# EAGLE schematic 01 Raspberry Hat 6 Schematic (EAGLE 8.5.2)

## Sheet 1 of 2
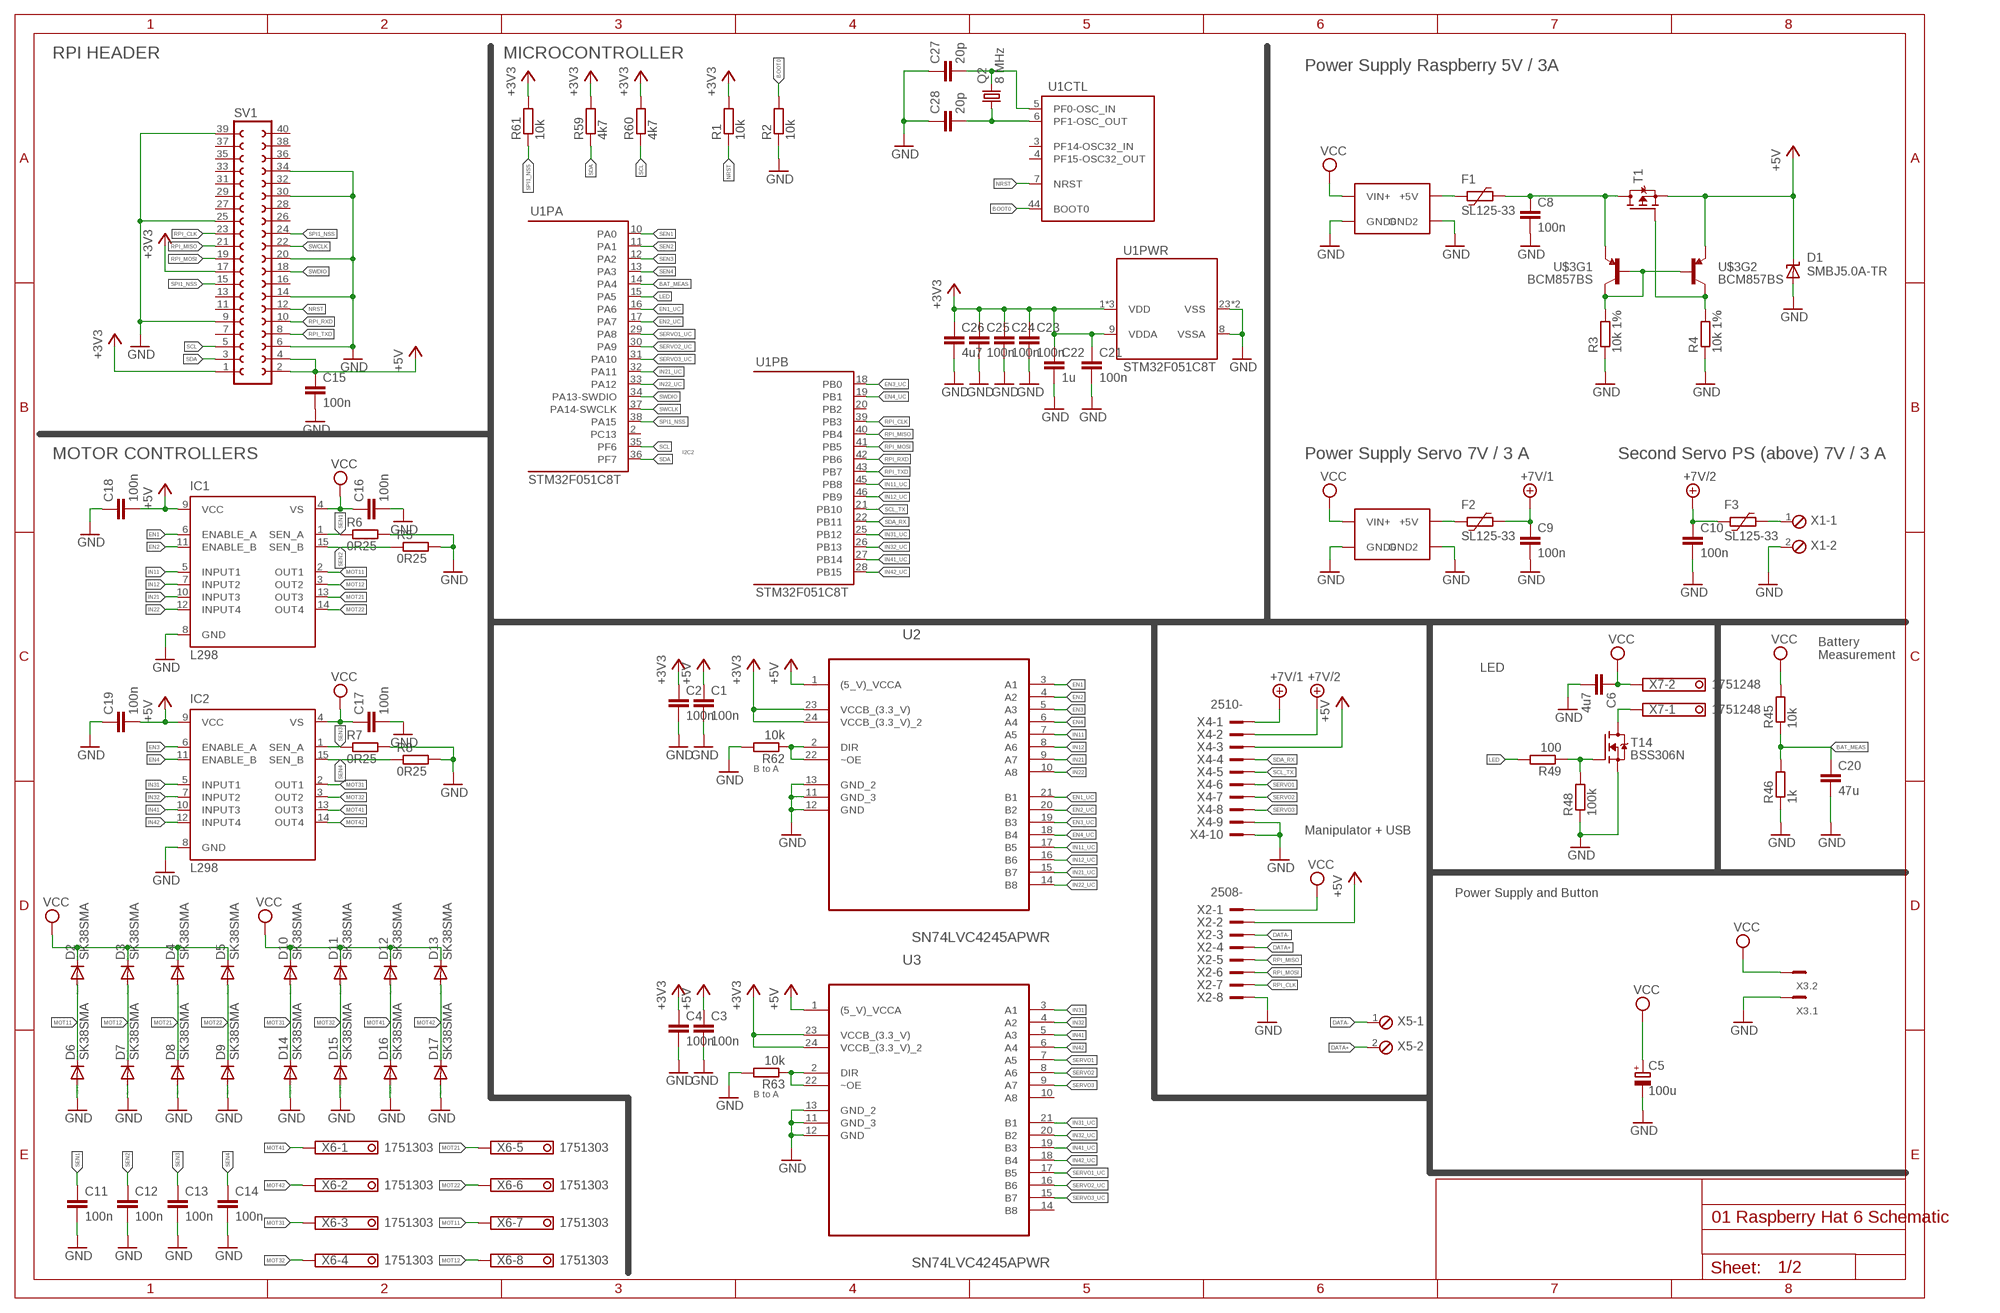
[diagram p0: schematic, sheet 1]

### Parts
C1  100n  C-EUC0805  [C0805]
C2  100n  C-EUC0805  [C0805]
C3  100n  C-EUC0805  [C0805]
C4  100n  C-EUC0805  [C0805]
C5  100u  CPOL-EU153CLV-0807  [153CLV-0807]
C6  4u7  C-EUC0805  [C0805]
C8  100n  C-EUC0805  [C0805]
C9  100n  C-EUC0805  [C0805]
C10  100n  C-EUC0805  [C0805]
C11  100n  C-EUC0805  [C0805]
C12  100n  C-EUC0805  [C0805]
C13  100n  C-EUC0805  [C0805]
C14  100n  C-EUC0805  [C0805]
C15  100n  C-EUC0805  [C0805]
C16  100n  C-EUC0805  [C0805]
C17  100n  C-EUC0805  [C0805]
C18  100n  C-EUC0805  [C0805]
C19  100n  C-EUC0805  [C0805]
C20  47u  C-EUC0805  [C0805]
C21  100n  C-EUC0805  [C0805]
C22  1u  C-EUC0805  [C0805]
C23  100n  C-EUC0805  [C0805]
C24  100n  C-EUC0805  [C0805]
C25  100n  C-EUC0805  [C0805]
C26  4u7  C-EUC0805  [C0805]
C27  20p  C-EUC0805  [C0805]
C28  20p  C-EUC0805  [C0805]
D1  SMBJ5.0A-TR  SUPPRESSOR-SMBJ  [SMBJ]
D2  SK38SMA  DIODE-DO214AC  [DO214AC]
D3  SK38SMA  DIODE-DO214AC  [DO214AC]
D4  SK38SMA  DIODE-DO214AC  [DO214AC]
D5  SK38SMA  DIODE-DO214AC  [DO214AC]
D6  SK38SMA  DIODE-DO214AC  [DO214AC]
D7  SK38SMA  DIODE-DO214AC  [DO214AC]
D8  SK38SMA  DIODE-DO214AC  [DO214AC]
D9  SK38SMA  DIODE-DO214AC  [DO214AC]
D10  SK38SMA  DIODE-DO214AC  [DO214AC]
D11  SK38SMA  DIODE-DO214AC  [DO214AC]
D12  SK38SMA  DIODE-DO214AC  [DO214AC]
D13  SK38SMA  DIODE-DO214AC  [DO214AC]
D14  SK38SMA  DIODE-DO214AC  [DO214AC]
D15  SK38SMA  DIODE-DO214AC  [DO214AC]
D16  SK38SMA  DIODE-DO214AC  [DO214AC]
D17  SK38SMA  DIODE-DO214AC  [DO214AC]
F1  SL125-33  2920L050  [2920L]
F2  SL125-33  2920L050  [2920L]
F3  SL125-33  2920L050  [2920L]
IC1  L298  [MULTIWATT-15]
IC2  L298  [MULTIWATT-15]
Q2  8 MHz  CRYSTALHC49UP  [HC49UP]
R1  10k  R-EU_M0805  [M0805]
R2  10k  R-EU_M0805  [M0805]
R3  10k 1%  R-EU_M0805  [M0805]
R4  10k 1%  R-EU_M0805  [M0805]
R5  0R25  R-EU_R2512  [R2512]
R6  0R25  R-EU_R2512  [R2512]
R7  0R25  R-EU_R2512  [R2512]
R8  0R25  R-EU_R2512  [R2512]
R45  10k  R-EU_M0805  [M0805]
R46  1k  R-EU_M0805  [M0805]
R48  100k  R-EU_M0805  [M0805]
R49  100  R-EU_M0805  [M0805]
R59  4k7  R-EU_M0805  [M0805]
R60  4k7  R-EU_M0805  [M0805]
R61  10k  R-EU_M0805  [M0805]
R62  10k  R-EU_M0805  [M0805]
R63  10k  R-EU_M0805  [M0805]
SV1  FE20-2  [FE20-2]
T1  MOSFET-P-SOT23  [SOT23]
T14  BSS306N  MOSFET-N-SOT23  [SOT23]
U1  STM32F051C8T  [LQFP48]
U2  SN74LVC4245APWR  [SOP65P640X120-24N]
U3  SN74LVC4245APWR  [SOP65P640X120-24N]
U$2  LM2596_CONVERTER  [LM2596_CONVERTER]
U$3  BCM857BS  [SOT363]
U$4  LM2596_CONVERTER  [LM2596_CONVERTER]
X1  MPT2  [2POL254]
X2  2508-  [PAK100/2500-10]
X3  MC2  [MC2]
X4  2510-  [PAK100/2500-10]
X5  MPT2  [2POL254]
X6  1751303  [1751303]
X7  1751248  [1751248]

### Nets
+3V3: C2.1 C4.1 C21.1 C22.1 C23.1 C24.1 C25.1 C26.1 R1.2 R59.2 R60.2 R61.2 SV1.1 SV1.17 U1.1(PWR:VDD) U1.9(PWR:VDDA) U1.24(PWR:VDD) U1.48(PWR:VDD) U2.23(VCCB_(3.3_V)) U2.24(VCCB_(3.3_V)_2) U3.23(VCCB_(3.3_V)) U3.24(VCCB_(3.3_V)_2)
+5V: C1.1 C3.1 C15.1 C18.2 C19.2 D1.C IC1.9(VCC) IC2.9(VCC) SV1.2 SV1.4 T1.2(S) U2.1((5_V)_VCCA) U3.1((5_V)_VCCA) U$3.4(E) X2.2 X4.3
+7V/1: C9.1 F2.1 X4.1
+7V/2: C10.1 F3.2 X4.2
BAT_MEAS: C20.1 R45.1 R46.2 U1.14(PA:PA4)
BOOT0: R2.2 U1.44(CTL:BOOT0)
DATA+: X2.4 X5.2
DATA-: X2.3 X5.1
EN1: IC1.6(ENABLE_A) U2.3(A1)
EN1_UC: U1.16(PA:PA6) U2.21(B1)
EN2: IC1.11(ENABLE_B) U2.4(A2)
EN2_UC: U1.17(PA:PA7) U2.20(B2)
EN3: IC2.6(ENABLE_A) U2.5(A3)
EN3_UC: U1.18(PB:PB0) U2.19(B3)
EN4: IC2.11(ENABLE_B) U2.6(A4)
EN4_UC: U1.19(PB:PB1) U2.18(B4)
GND: C1.2 C2.2 C3.2 C4.2 C5.- C6.2 C8.2 C9.2 C10.2 C11.2 C12.2 C13.2 C14.2 C15.2 C16.2 C17.2 C18.1 C19.1 C20.2 C21.2 C22.2 C23.2 C24.2 C25.2 C26.2 C27.1 C28.1 D1.A D6.A D7.A D8.A D9.A D14.A D15.A D16.A D17.A IC1.8(GND) IC2.8(GND) R2.1 R3.1 R4.1 R5.2 R6.2 R7.2 R8.2 R46.1 R48.1 R62.2 R63.2 SV1.6 SV1.9 SV1.14 SV1.20 SV1.25 SV1.30 SV1.34 SV1.39 T14.2(S) U1.8(PWR:VSSA) U1.23(PWR:VSS) U1.47(PWR:VSS) U2.11(GND_3) U2.12(GND) U2.13(GND_2) U3.11(GND_3) U3.12(GND) U3.13(GND_2) U$2.GND1(GND2) U$2.GND(GND0) U$4.GND1(GND2) U$4.GND(GND0) X1.2 X2.8 X3.1 X4.9 X4.10
IN11: IC1.5(INPUT1) U2.7(A5)
IN11_UC: U1.45(PB:PB8) U2.17(B5)
IN12: IC1.7(INPUT2) U2.8(A6)
IN12_UC: U1.46(PB:PB9) U2.16(B6)
IN21: IC1.10(INPUT3) U2.9(A7)
IN21_UC: U1.32(PA:PA11) U2.15(B7)
IN22: IC1.12(INPUT4) U2.10(A8)
IN22_UC: U1.33(PA:PA12) U2.14(B8)
IN31: IC2.5(INPUT1) U3.3(A1)
IN31_UC: U1.25(PB:PB12) U3.21(B1)
IN32: IC2.7(INPUT2) U3.4(A2)
IN32_UC: U1.26(PB:PB13) U3.20(B2)
IN41: IC2.10(INPUT3) U3.5(A3)
IN41_UC: U1.27(PB:PB14) U3.19(B3)
IN42: IC2.12(INPUT4) U3.6(A4)
IN42_UC: U1.28(PB:PB15) U3.18(B4)
LED: R49.2 U1.15(PA:PA5)
MOT11: D2.A D6.C IC1.2(OUT1) X6.7
MOT12: D3.A D7.C IC1.3(OUT2) X6.8
MOT21: D4.A D8.C IC1.13(OUT3) X6.5
MOT22: D5.A D9.C IC1.14(OUT4) X6.6
MOT31: D10.A D14.C IC2.2(OUT1) X6.3
MOT32: D11.A D15.C IC2.3(OUT2) X6.4
MOT41: D12.A D16.C IC2.13(OUT3) X6.1
MOT42: D13.A D17.C IC2.14(OUT4) X6.2
N$1: R62.1 U2.2(DIR) U2.22(~OE)
N$2: R63.1 U3.2(DIR) U3.22(~OE)
N$3: F1.2 U$2.+5V
N$4: C8.1 F1.1 T1.3(D) U$3.1(E)
N$5: F3.1 X1.1
N$6: R4.2 T1.1(G) U$3.3(C)
N$8: R3.2 U$3.2(B) U$3.5(B) U$3.6(C)
N$10: F2.2 U$4.+5V
N$21: R48.2 R49.1 T14.1(G)
N$24: T14.3(D) X7.1
N$28: C28.2 Q2.1 U1.6(CTL:PF1-OSC_OUT)
N$29: C27.2 Q2.2 U1.5(CTL:PF0-OSC_IN)
NRST: R1.1 SV1.12 U1.7(CTL:NRST)
RPI_CLK: SV1.23 U1.39(PB:PB3) X2.7
RPI_MISO: SV1.21 U1.40(PB:PB4) X2.5
RPI_MOSI: SV1.19 U1.41(PB:PB5) X2.6
RPI_RXD: SV1.10 U1.42(PB:PB6)
RPI_TXD: SV1.8 U1.43(PB:PB7)
SCL: R60.1 SV1.5 U1.35(PA:PF6)
SCL_TX: U1.21(PB:PB10) X4.5
SDA: R59.1 SV1.3 U1.36(PA:PF7)
SDA_RX: U1.22(PB:PB11) X4.4
SEN1: C11.1 IC1.1(SEN_A) R6.1 U1.10(PA:PA0)
SEN2: C12.1 IC1.15(SEN_B) R5.1 U1.11(PA:PA1)
SEN3: C13.1 IC2.1(SEN_A) R7.1 U1.12(PA:PA2)
SEN4: C14.1 IC2.15(SEN_B) R8.1 U1.13(PA:PA3)
SERVO1: U3.7(A5) X4.6
SERVO1_UC: U1.29(PA:PA8) U3.17(B5)
SERVO2: U3.8(A6) X4.7
SERVO2_UC: U1.30(PA:PA9) U3.16(B6)
SERVO3: U3.9(A7) X4.8
SERVO3_UC: U1.31(PA:PA10) U3.15(B7)
SPI1_NSS: R61.1 SV1.15 SV1.24 U1.38(PA:PA15)
SWCLK: SV1.22 U1.37(PA:PA14-SWCLK)
SWDIO: SV1.18 U1.34(PA:PA13-SWDIO)
VCC: C5.+ C6.1 C16.1 C17.1 D2.C D3.C D4.C D5.C D10.C D11.C D12.C D13.C IC1.4(VS) IC2.4(VS) R45.2 U$2.IN+(VIN+) U$4.IN+(VIN+) X2.1 X3.2 X7.2
Unconnected: SV1.7 SV1.11 SV1.13 SV1.16 SV1.26 SV1.27 SV1.28 SV1.29 SV1.31 SV1.32 SV1.33 SV1.35 SV1.36 SV1.37 SV1.38 SV1.40 U1.2(PA:PC13) U1.3(CTL:PF14-OSC32_IN) U1.4(CTL:PF15-OSC32_OUT) U1.20(PB:PB2) U3.10(A8) U3.14(B8)

### Notes on the sheet
- RPI HEADER | MICROCONTROLLER
- Power Supply Raspberry 5V / 3A
- I2C2
- MOTOR CONTROLLERS | Power Supply Servo 7V / 3 A | Second Servo PS (above) 7V / 3 A
- Battery
  Measurement
- LED
- B to A
- Manipulator + USB
- Power Supply and Button
- B to A

## Sheet 2 of 2
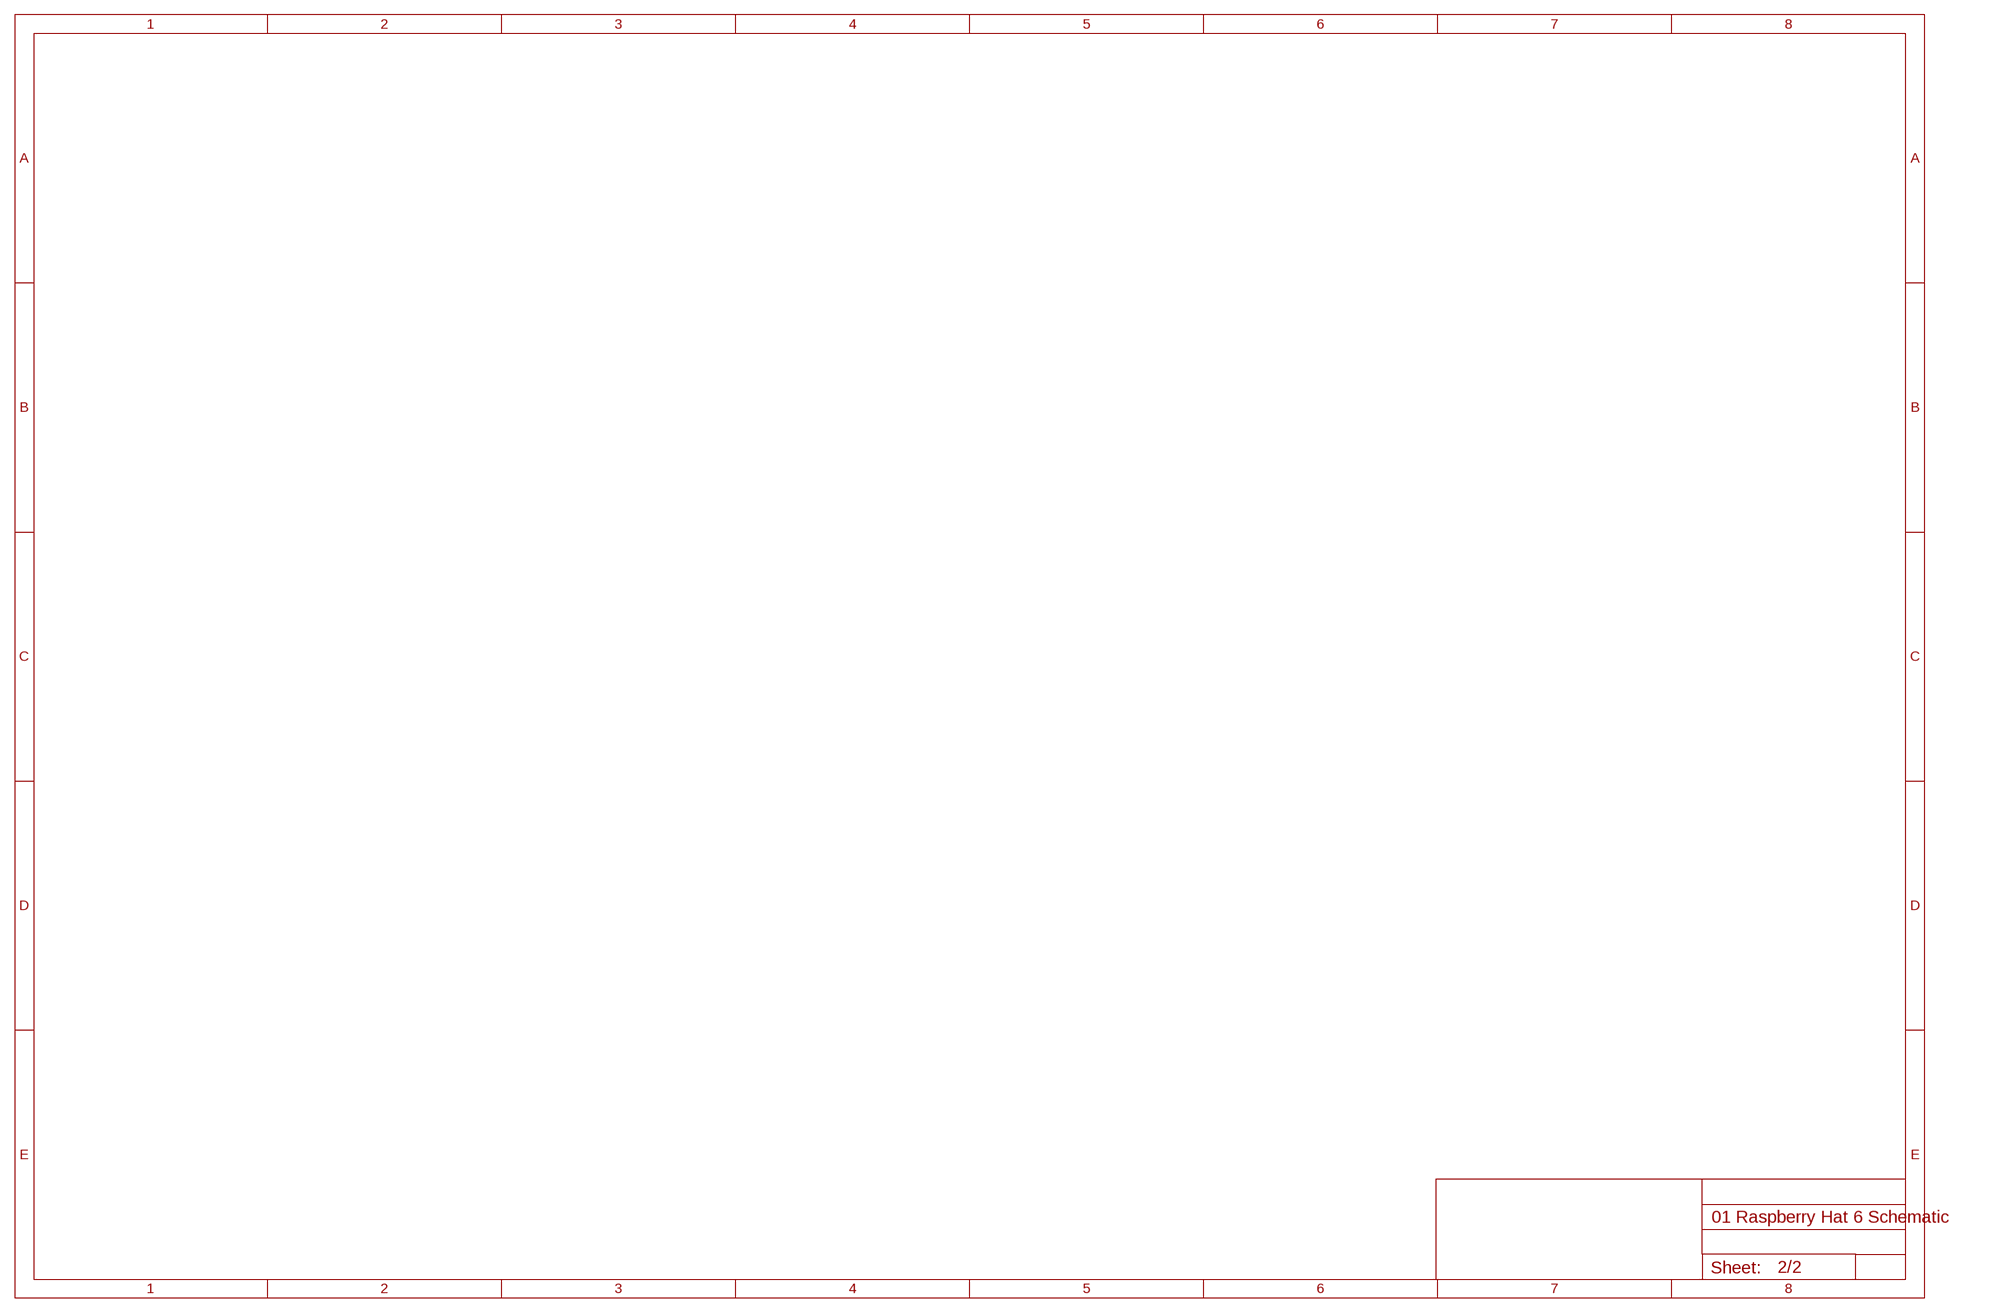
[diagram p1: schematic, sheet 2]

## Library data of the parts
C1-C4 C6 C8-C19 C21-C28 = resistor:C-EU: CAPACITOR, European symbol
C5 = resistor:CPOL-EU: POLARIZED CAPACITOR, European symbol; LINK: http://www.tme.eu/pl/details/sc1e107m0806bvr/kondensatory-elektrolityczne-smd-85c/samwha/
C20 = resistor:C-EU: CAPACITOR, European symbol; LINK: http://www.tme.eu/pl/details/cl21a476mqynnng/kondensatory-mlcc-smd-0805/samsung/
D1 = diode:SUPPRESSOR-: Suppressor diode; LINK: http://www.tme.eu/pl/details/smbj5.0a-tr/diody-transil-smd-jednokierunkowe/st-microelectronics/
D2-D17 = diode:DIODE-: DIODE; LINK: http://www.tme.eu/pl/details/sk38sma-dio/diody-schottky-smd/diotec-semiconductor/sk38sma/
F1 = polyfuse-smd_10:?: Polyfuse Resettable PTC Source: http://www.littelfuse.com/products/resettable-ptcs.aspx; LINK: http://www.tme.eu/pl/details/sl125-33/bezpieczniki-polimerowe-smd/ece/; MF: Littelfuse; MPN: 2920L050; OC_FARNELL: 1822223; OC_NEWARK: 18M4790
F2 F3 = polyfuse-smd_10:?: Polyfuse Resettable PTC Source: http://www.littelfuse.com/products/resettable-ptcs.aspx; LINK: http://www.tme.eu/pl/details/sl075-33/bezpieczniki-polimerowe-smd/ece/; MF: Littelfuse; MPN: 2920L050; OC_FARNELL: 1822223; OC_NEWARK: 18M4790
IC1 IC2 = st-microelectronics:L298: DUAL FULL-BRIDGE DRIVER; MPN: L298N; OC_FARNELL: 1589425; OC_NEWARK: 32M1527
Q2 = crystal:CRYSTAL: CRYSTAL; LINK: YIC 49SLMT 8.00MHZ 20PF 30PPM; OC_FARNELL: unknown; OC_NEWARK: unknown
R1-R4 R45 R46 R48 R49 R59-R63 = resistor:R-EU_: RESISTOR, European symbol
R5-R8 = rcl:R-EU_: RESISTOR, European symbol; LINK: http://www.tme.eu/pl/details/cs2512-0r25-1%25-hp/rezystory-smd-2512/viking/cs12ftfsr250/
SV1 = con-lsta:FE20-2: FEMALE HEADER; OC_FARNELL: unknown; OC_NEWARK: unknown
T1 = we-transistor:MOSFET-P: P-Channel MOSFET (e.g. IRLML6402); LINK: http://www.tme.eu/pl/details/dmp2305u-7/tranzystory-z-kanalem-p-smd/diodes-incorporated/
T14 = we-transistor:MOSFET-N: N-Channel MOSFET (e.g. IRLML2502, BSS138)
U1 = STM32F030:STM32F051C: STM32F051 in LQPF48 package. STM32F0-series Cortex-M0 microcontroller in a 48 lead package. Datasheet <http://www.st.com/web/en/resource/technical/document/datasheet/DM00039193.pdf> (DM00039193.pdf) .; FLASH: 64K
U2 U3 = Texas Instruments_By_element14_Batch_1:SN74LVC4245APWR: OCTAL BUS TRANSCEIVER AND 3.3-V TO 5-V SHIFTER WITH 3-STATE OUTPUTS; MPN: SN74LVC4245APWR; OC_FARNELL: 1470935; OC_NEWARK: 92B8894; PACKAGE: TSSOP-24; SUPPLIER: Texas Instruments
U$2 U$4 = Voltage Converter:LM2596_CONVERTER: https://botland.com.pl/przetwornice-step-down/2967-przetwornica-step-down-lm2596-15v-35v-3a.html?search_query=przetwornica+step-down&results=71 HEIGHT 14 mm
U$3 = BCM857BS:BCM857BS: NPN/PNP transistor pair in SOT-363 package http://www.tme.eu/pl/Document/3ea3302220f52372b0e794796e7ba661/BCM847BS.pdf http://www.tme.eu/pl/details/bcm857bs/tranzystory-pnp-smd/nxp/; LINK: http://www.tme.eu/pl/details/bcm857bs/tranzystory-pnp-smd/nxp/
X1 X5 = con-phoenix-254:MPT2: PHOENIX CONNECTOR; OC_FARNELL: unknown; OC_NEWARK: unknown
X2 = Simplex-Connectors:2508-: 3M (TM) Pak 100 4-Wall Header Source: 3M; MF: 3M; MPN: 2510-6002UB; OC_FARNELL: 9838244; OC_NEWARK: 46F4725
X3 = con-phoenix-381_l:MC2: Mini-Combicon 3.81mm horizontal 2-polig (ohne Gegenstecker)
X4 = con-3m:2510-: 3M (TM) Pak 100 4-Wall Header Source: 3M; MF: 3M; MPN: 2510-6002UB; OC_FARNELL: 9838244; OC_NEWARK: 46F4725
X6 = con-phoenix-350:1751303: MKDS 1/ 8-3,5 Printklemme Nennstrom: 10 A Bemessungsspannung: 160 V Raster: 3,5 mm Polzahl: 8 Montageart: Löten Anschlussart: Schraubanschluss Anschlussrichtung vom Leiter zur Platine: 0° Source: http://eshop.phoenixcontact.com .. .pdf; OC_FARNELL: unknown; OC_NEWARK: unknown
X7 = con-phoenix-350:1751248: MKDS 1/ 2-3,5 Printklemme Nennstrom: 10 A Bemessungsspannung: 160 V Raster: 3,5 mm Polzahl: 2 Montageart: Löten Anschlussart: Schraubanschluss Anschlussrichtung vom Leiter zur Platine: 0° Source: http://eshop.phoenixcontact.com .. 1751248.pdf; OC_FARNELL: unknown; OC_NEWARK: unknown